# EAGLE design buzzer (EAGLE 6.2)
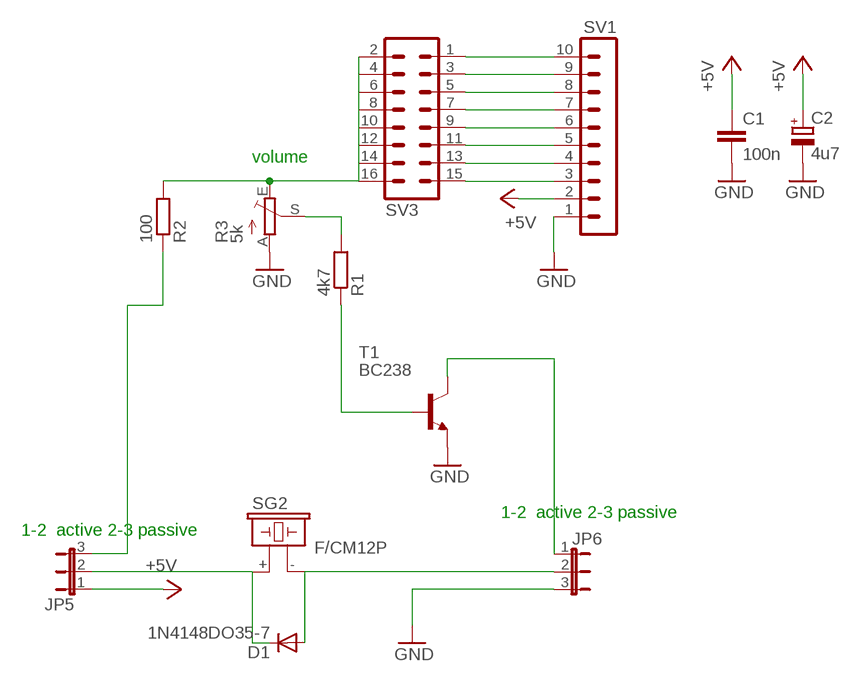
[diagram p0: schematic, sheet 1]

## Parts
C1  100n  C-EU025-024X044  [C025-024X044]
C2  4u7  CPOL-EUTT2D5  [TT2D5]
D1  1N4148DO35-7  [DO35-7]
JP5  JP2W  [JP2W]
JP6  JP2W  [JP2W]
R1  4k7  R-EU_0617/17  [0617/17]
R2  100  R-EU_0207/10  [0207/10]
R3  5k  TRIM_EU-CA9V  [CA9V]
SG2  F/CM12P  [F/CM12P]
SV1  MA10-1W  [MA10-1W]
SV3  MA08-2  [MA08-2]
T1  BC238  -NPN-TO5  [TO5]

## Nets
+5V: C1.1 C2.+ JP5.1 SV1.2
GND: C1.2 C2.- JP6.3 R3.A SV1.1 T1.1(E)
N$1: R2.2 R3.E SV3.2 SV3.4 SV3.6 SV3.8 SV3.10 SV3.12 SV3.14 SV3.16
N$2: R1.2 R3.S
N$3: R1.1 T1.2(B)
N$4: D1.C JP5.2 SG2.+
N$5: JP5.3 R2.1
N$6: SV1.3 SV3.15
N$7: D1.A JP6.2 SG2.-
N$8: SV1.4 SV3.13
N$9: SV1.5 SV3.11
N$10: JP6.1 T1.3(C)
N$11: SV1.6 SV3.9
N$12: SV1.7 SV3.7
N$13: SV1.8 SV3.5
N$14: SV1.9 SV3.3
N$15: SV1.10 SV3.1

## Notes on the sheet
- volume
- 1-2  active 2-3 passive
- 1-2  active 2-3 passive

## Library data of the parts
C1 = rcl:C-EU: CAPACITOR, European symbol
C2 = rcl:CPOL-EU: POLARIZED CAPACITOR, European symbol
D1 = diode:1N4148: DIODE high speed (Philips)
JP5 JP6 = jumper:JP2W: JUMPER
R1 R2 = rcl:R-EU_: RESISTOR, European symbol
R3 = pot:TRIM_EU-: POTENTIOMETER
SG2 = buzzer:F/CM12P: BUZZER Source: Buerklin
SV1 = con-lstb:MA10-1W: PIN HEADER
SV3 = con-lstb:MA08-2: PIN HEADER
T1 = transistor:*-NPN-: NPN Transistror BF959 corrected 2008.03.06

## Board
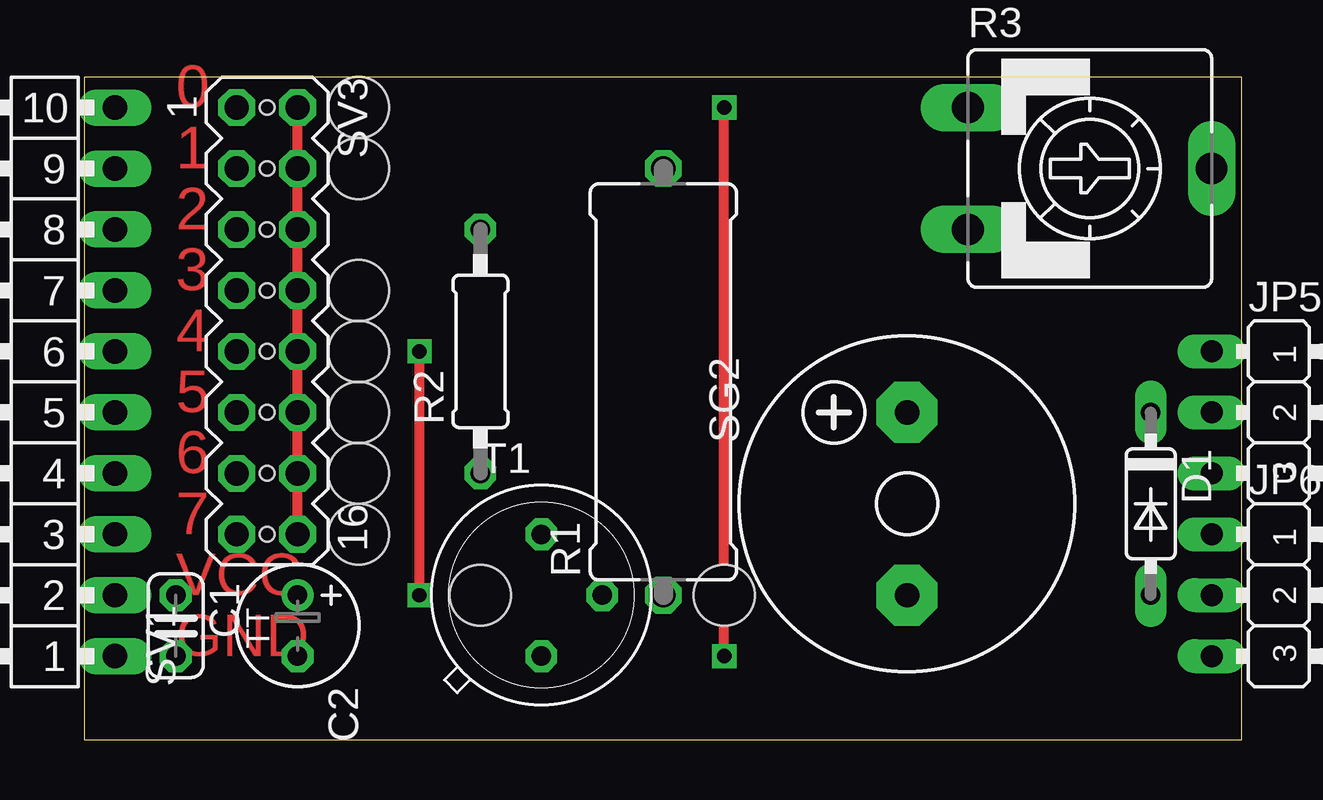
[diagram p1: board, top side]
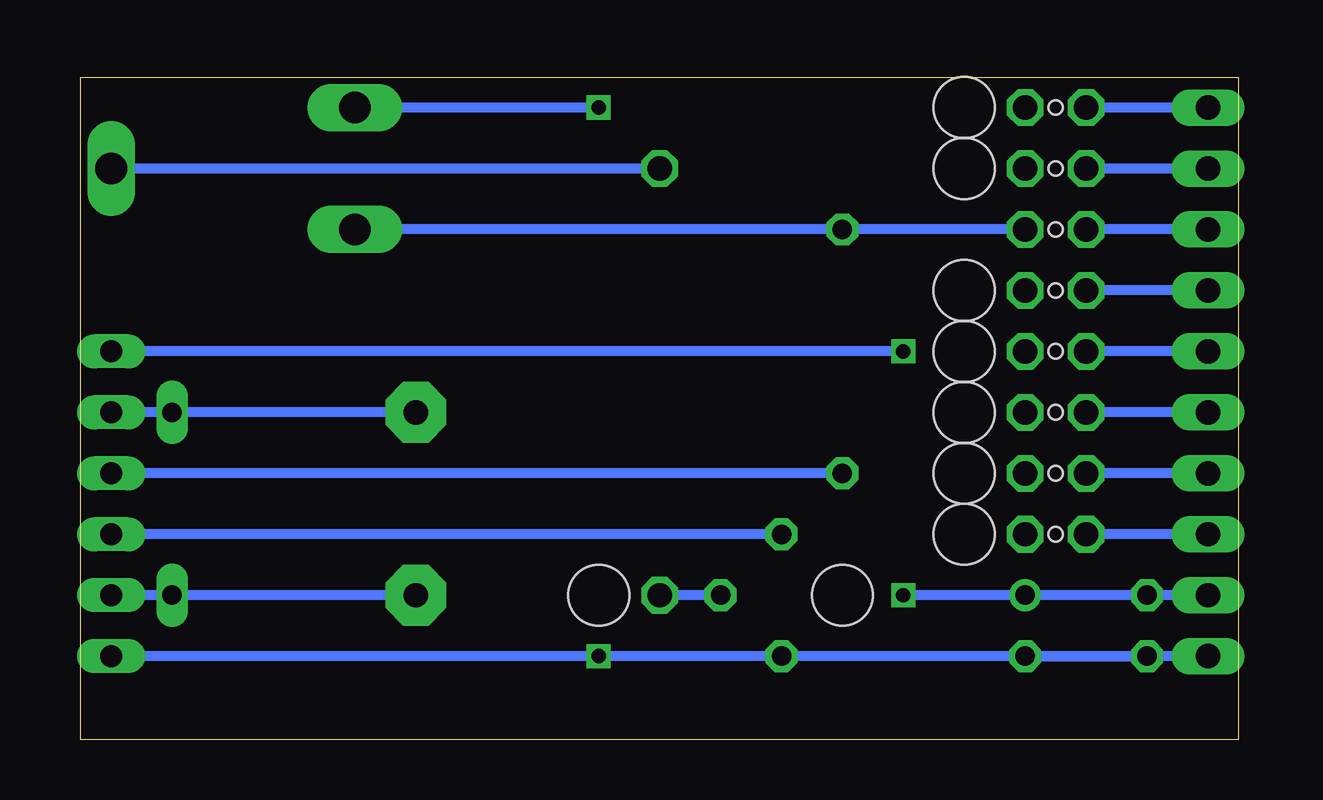
[diagram p2: board, bottom side, seen from below]

Size 48.25 x 27.61 mm. Coordinates in mm from the lower left corner, seen from the top.
Outline: 0,27.61 0,0 48.25,0 48.25,27.61 0,27.61
Copper layers (1*16): Top 0.035mm / dielectric 1.5mm / Bottom 0.035mm
Design rules: minimum track width 10mil, minimum drill 24mil, track to track 8mil, track to pad 8mil, pad to pad 8mil, via to via 8mil, smd to smd 8mil, copper to edge 40mil, drill to drill 8mil, minimum pad ring 10mil, minimum via ring 8mil, stop-mask expansion 4mil, vias tented up to drill 0mil, thermal gap 10mil
Holes 2.54 mm at 11.43,26.34 11.43,23.8 11.43,18.72 11.43,16.18 11.43,13.64 11.43,11.1 11.43,8.56 16.51,6.02 26.67,6.02
Holes 0.6 mm at 7.62,26.34 7.62,23.8 7.62,21.26 7.62,18.72 7.62,16.18 7.62,13.64 7.62,11.1 7.62,8.56

### Footprints (pad centres in the part's own frame; a part is rotated, then mirrored left to right if it is on the bottom)
C025-024X044 = drill 0.813 octagon: 1 -1.27,0; 2 1.27,0
TT2D5 = drill 0.813: + -1.27,0 | drill 0.813 octagon: - 1.27,0
DO35-7 = drill 0.813 long: A 3.81,0; C -3.81,0
JP2W = drill 0.914 long: 1 -2.54,-1.27; 2 0,-1.27; 3 2.54,-1.27
0617/17 = drill 1.016 octagon: 1 -8.89,0; 2 8.89,0
0207/10 = drill 0.813 octagon: 1 -5.08,0; 2 5.08,0
CA9V = drill 1.321 long: A -2.54,-5.08; E 2.54,-5.08; S 0,5.08
F/CM12P = drill 1.016 pad 2.54 octagon: + 3.81,0; - -3.81,0
MA10-1W = drill 1.016 long: 1 -11.43,0; 2 -8.89,0; 3 -6.35,0; 4 -3.81,0; 5 -1.27,0; 6 1.27,0; 7 3.81,0; 8 6.35,0; 9 8.89,0; 10 11.43,0
MA08-2 = drill 1.016 octagon: 1 -8.89,-1.27; 2 -8.89,1.27; 3 -6.35,-1.27; 4 -6.35,1.27; 5 -3.81,-1.27; 6 -3.81,1.27; 7 -1.27,-1.27; 8 -1.27,1.27; 9 1.27,-1.27; 10 1.27,1.27; 11 3.81,-1.27; 12 3.81,1.27; 13 6.35,-1.27; 14 6.35,1.27; 15 8.89,-1.27; 16 8.89,1.27
TO5 = drill 0.813 octagon: 1 0,-2.54; 2 2.54,0; 3 0,2.54

### Placement (x,y rotation side)
C1  3.81,4.75 270 top
C2  8.89,4.75 270 top
D1  44.45,9.83 270 top
JP5  48.26,13.64 270 top
JP6  48.26,6.02 270 top
R1  24.13,14.91 90 top
R2  16.51,16.18 90 top
R3  41.91,23.8 270 top
SG2  34.29,9.83 90 top
SV1  1.27,14.91 90 top
SV3  7.62,17.45 270 top
T1  19.05,6.02 0 top

### Tracks (layer width: path | path; a pad name or v marks a point on that pad's centre or on a via)
+5V  (via drill 0.6)
  Top 0.406: v13.97,6.02 v13.97,16.18
  Bottom 0.406: SV1.2 C1.1 C2.+ v13.97,6.02 | v13.97,16.18 JP5.1
GND  (via drill 0.6)
  Top 0.406: v26.67,3.48 v26.67,26.34
  Bottom 0.406: SV1.1 C2.- | C2.- C1.2 | C2.- T1.1 v26.67,3.48 JP6.3 | v26.67,26.34 R3.A
N$1
  Top 0.406: SV3.2 SV3.4 SV3.6 SV3.8 SV3.10 SV3.12 SV3.14 SV3.16
  Bottom 0.406: R3.E R2.2 SV3.6
N$2
  Bottom 0.406: R1.2 R3.S
N$3
  Bottom 0.406: T1.2 R1.1
N$4
  Bottom 0.406: SG2.+ D1.C JP5.2
N$5
  Bottom 0.406: R2.1 JP5.3
N$6
  Bottom 0.406: SV1.3 SV3.15
N$7
  Bottom 0.406: SG2.- D1.A JP6.2
N$8
  Bottom 0.406: SV1.4 SV3.13
N$9
  Bottom 0.406: SV1.5 SV3.11
N$10
  Bottom 0.406: T1.3 JP6.1
N$11
  Bottom 0.406: SV1.6 SV3.9
N$12
  Bottom 0.406: SV1.7 SV3.7
N$13
  Bottom 0.406: SV1.8 SV3.5
N$14
  Bottom 0.406: SV1.9 SV3.3
N$15
  Bottom 0.406: SV1.10 SV3.1

### Text on the board
Top: 0 | 1 | 2 | 3 | 4 | 5 | 6 | 7 | VCC | GND
Document: volume by active | volume by active | 1-2 active | 2-3 passive | 1-2 active | 2-3 passive